# EAGLE design Tracksoar v2 (EAGLE 7.5.0)
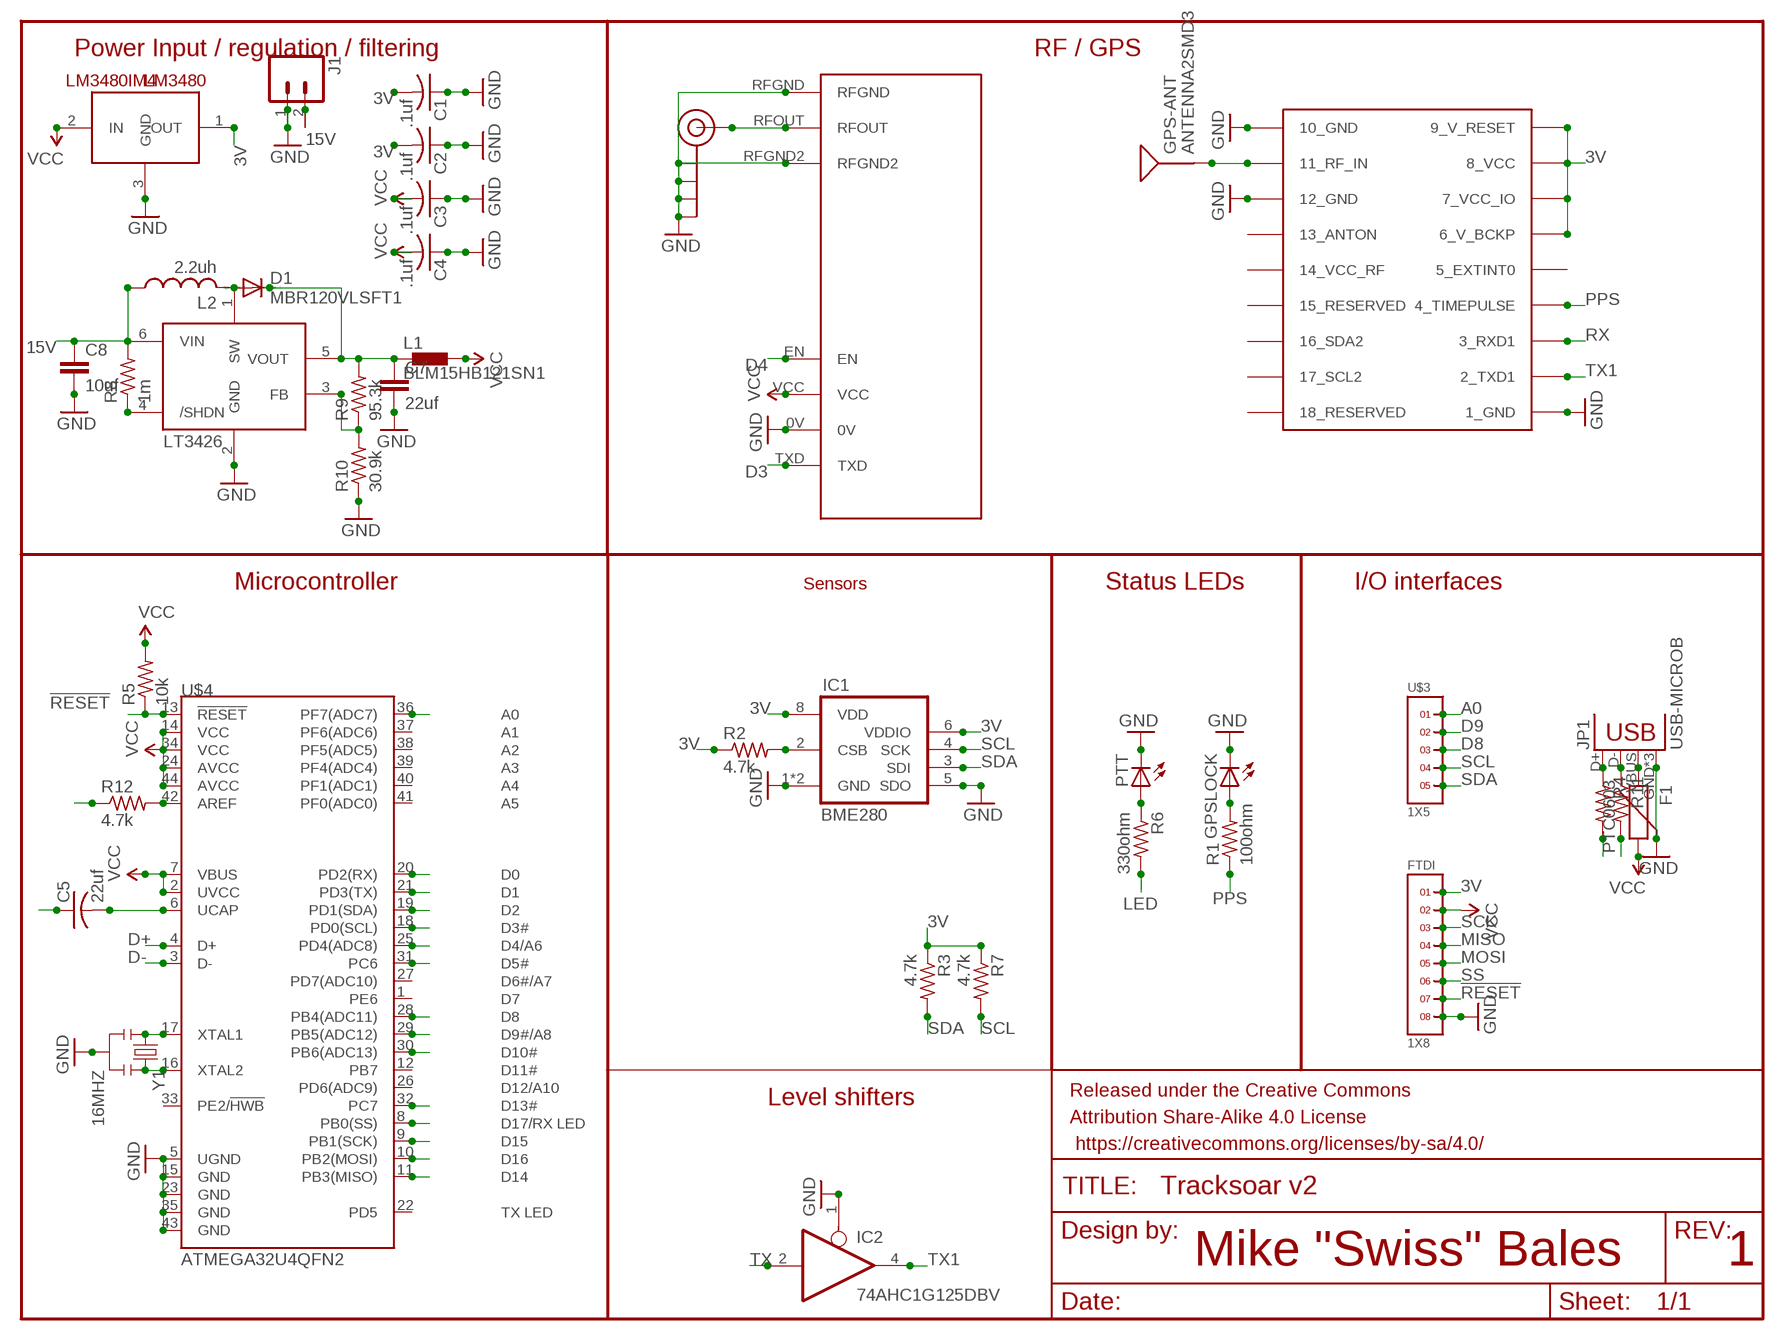
[diagram p0: schematic, sheet 1]

## Parts
C1  .1uf  C-USC0402  [C0402]
C2  .1uf  C-USC0402  [C0402]
C3  .1uf  C-USC0402  [C0402]
C4  .1uf  C-USC0402  [C0402]
C5  22uf  C-USC0402  [C0402]
C7  22uf  CAP0805  [0805]
C8  10uf  CAP0805  [0805]
D1  MBR120VLSFT1  DIODE-SOD123  [SOD123]
F1  PTC0603  [0603]
FRAME1  FRAME-LETTER  [CREATIVE_COMMONS]
FTDI  1X8  [1X8]
GPS-ANT  ANTENNA2SMD3  [ANTENNA-CHIP4]
GPSLOCK  LEDCHIP-LED0603  [CHIP-LED0603]
IC1  BME280  [BME280]
IC2  74AHC1G125DBV  [SOT23-5]
J1  M02JST-PTH-2  [JST-2-PTH]
J$1  SMA_EDGE  [SMA-EDGE]
JP1  USB-MICROB  [USB-MICROB]
L1  BLM15HB121SN1  [0402]
L2  2.2uh  L-USL1812  [L1812]
LM3480  LM3480IM4  [SOT23-3]
LT3426  LT3426  [SOT23-6]
PTT  LEDCHIP-LED0603  [CHIP-LED0603]
R1  100ohm  R-US_R0402  [R0402]
R2  4.7k  R-US_R0402  [R0402]
R3  4.7k  R-US_R0402  [R0402]
R4  R-US_R0402  [R0402]
R5  10k  R-US_R0402  [R0402]
R6  330ohm  R-US_R0402  [R0402]
R7  4.7k  R-US_R0402  [R0402]
R8  1m  R-US_R0402  [R0402]
R9  95.3k  R-US_R0402  [R0402]
R10  30.9k  R-US_R0402  [R0402]
R11  R-US_R0402  [R0402]
R12  4.7k  R-US_R0402  [R0402]
U$1  UBLOX_MAX  [UBLOX_MAX]
U$2  RADIOMETRIX-HX1  [RADIOMETRIX-HX1]
U$3  1X5  [1X5]
U$4  ATMEGA32U4QFN2  [QFN-44-NOPAD]
Y1  16MHZ  RESONATOR16MHZ  [RESONATOR-SMD]

## Nets
3V: C1.2 C2.2 FTDI.1 IC1.6(VDDIO) IC1.8(VDD) LM3480.1(OUT) R2.1 R3.1 R7.1 U$1.6_V_BCKP U$1.7_VCC_IO U$1.8_VCC U$1.9_V_RESET
15V: C8.1 J1.2 L2.1 LT3426.6(VIN) R8.2 R12.1
!RESET: FTDI.7 R5.1 U$4.13(!RESET)
A0: U$3.1 U$4.36(PF7(ADC7))
D3: U$2.TXD U$4.30(PB6(ADC13))
D4: U$2.EN U$4.25(PD4(ADC8))
D8: U$3.3 U$4.28(PB4(ADC11))
D9: U$3.2 U$4.29(PB5(ADC12))
D13: U$4.32(PC7)
D+: R4.2 U$4.4(D+)
D-: R11.2 U$4.3(D-)
GND: C1.1 C2.1 C3.1 C4.1 C5.1 C7.2 C8.2 FTDI.8 GPSLOCK.C IC1.1(GND) IC1.5(SDO) IC1.7(GND) IC2.1(OE) J1.1 J$1.GND@0(GND) J$1.GND@1(GND) J$1.GND@2(GND) J$1.GND@3(GND) JP1.GND JP1.MT1(GND) JP1.MT2(GND) LM3480.3(GND) LT3426.2(GND) PTT.C R10.1 U$1.1_GND U$1.10_GND U$1.12_GND U$2.0V U$2.RFGND U$2.RFGND2 U$4.5(UGND) U$4.15(GND) U$4.23(GND) U$4.35(GND) U$4.43(GND) Y1.2
LED: R6.2 U$4.31(PC6)
MISO: FTDI.4 U$4.11(PB3(MISO))
MOSI: FTDI.5 U$4.10(PB2(MOSI))
N$1: J$1.SIG(SIGNAL) U$2.RFOUT
N$2: IC1.2(CSB) R2.2
N$3: GPSLOCK.A R1.2
N$6: GPS-ANT.SIG(SIGNAL) U$1.11_RF_IN
N$7: JP1.D- R11.1
N$8: JP1.D+ R4.1
N$9: D1.A L2.2 LT3426.1(SW)
N$12: LT3426.4(/SHDN) R8.1
N$13: LT3426.3(FB) R9.1 R10.2
N$14: F1.1 JP1.VBUS
N$17: R12.2 U$4.42(AREF)
N$19: C7.1 D1.C L1.1 LT3426.5(VOUT) R9.2
N$20: C5.2 U$4.6(UCAP)
N$27: PTT.A R6.1
PPS: R1.1 U$1.4_TIMEPULSE
RX: U$1.3_RXD1 U$4.21(PD3(TX))
SCK: FTDI.3 U$4.9(PB1(SCK))
SCL: IC1.4(SCK) R7.2 U$3.4 U$4.18(PD0(SCL))
SDA: IC1.3(SDI) R3.2 U$3.5 U$4.19(PD1(SDA))
SS: FTDI.6 U$4.8(PB0(SS))
TX: IC2.2(I) U$4.20(PD2(RX))
TX1: IC2.4(O) U$1.2_TXD1
VCC: C3.2 C4.2 F1.2 FTDI.2 L1.2 LM3480.2(IN) R5.2 U$2.VCC U$4.2(UVCC) U$4.7(VBUS) U$4.14(VCC) U$4.24(AVCC) U$4.34(VCC) U$4.44(AVCC)
XTAL1: U$4.17(XTAL1) Y1.1
XTAL2: U$4.16(XTAL2) Y1.3
Unconnected: U$1.5_EXTINT0 U$1.13_ANTON U$1.14_VCC_RF U$1.15_RESERVED U$1.16_SDA2 U$1.17_SCL2 U$1.18_RESERVED U$4.1(PE6) U$4.12(PB7) U$4.22(PD5) U$4.26(PD6(ADC9)) U$4.27(PD7(ADC10)) U$4.33(PE2/!HWB) U$4.37(PF6(ADC6)) U$4.38(PF5(ADC5)) U$4.39(PF4(ADC4)) U$4.40(PF1(ADC1)) U$4.41(PF0(ADC0))

## Notes on the sheet
- Power Input / regulation / filtering | RF / GPS
- Microcontroller | Sensors | Status LEDs | I/O interfaces
- Level shifters
- Mike "Swiss" Bales | 1

## Power pins joined to a net without a drawn wire
GND: IC2.3(GND)
VCC: IC2.5(VCC)

## Library data of the parts
C1-C4 = adafruit:C-US: CAPACITOR, American symbol
C5 = rcl:C-US: CAPACITOR, American symbol
C7 C8 = SparkFun-Capacitors:CAP: Capacitor Standard 0603 ceramic capacitor, and 0.1" leaded capacitor.
D1 = diode:DIODE-: DIODE
F1 = SparkFun-PowerIC:PTC: Resettable Fuse PTC Resettable Fuse. Spark Fun Electronics SKU : COM-08357
FRAME1 = SparkFun-Aesthetics:FRAME-LETTER: Schematic Frame Standard 8.5x11 US Letter frame
FTDI = headers(2mm):1X8
GPS-ANT = SparkFun-RF:ANTENNA2: Chip antenna Single endded antenna. Common with smaller chip antennas. CHIP4 package is the GPS Chip Antenna SKU: GPS-08418. CHIP5 package is 2.4GHz chip antenna SKU: WRL-00144.
GPSLOCK PTT = adafruit:LED: LED OSRAM: - CHIPLED LG R971, LG N971, LY N971, LG Q971, LY Q971, LO R971, LY R971 LH N974, LH R974 LS Q976, LO Q976, LY Q976 LO Q996 - Hyper CHIPLED LW Q18S LB Q993, LB Q99A, LB R99A - SideLED LS A670, LO A670, LY A670, LG A670, LP A670 LB A673, LV A673, LT A673, LW A673 LH A674 LY A675 LS A676, LA A676, LO A676, LY A676, LW A676 LS A679, LY A679, LG A679 - Hyper Micro SIDELED® LS Y876, LA Y876, LO Y876, LY Y876 LT Y87S - SmartLED LW L88C, LW L88S LB L89C, LB L89S, LG L890 LS L89K, LO L89K, LY L89K LS L896, LA L896, LO L896, LY L896 - TOPLED LS T670, LO T670, LY T670, LG T670, LP T670 LSG T670, LSP T670, LSY T670, LOP T670, LYG T670 LG T671, LOG T671, LSG T671 LB T673, LV T673, LT T673, LW T673 LH T674 LS T676, LA T676, LO T676, LY T676, LB T676, LH T676, LSB T676, LW T676 LB T67C, LV T67C, LT T67C, LS T67K, LO T67K, LY T67K, LW E67C LS E67B, LA E67B, LO E67B, LY E67B, LB E67C, LV E67C, LT E67C LW T67C LS T679, LY T679, LG T679 LS T770, LO T770, LY T770, LG T770, LP T770 LB T773, LV T773, LT T773, LW T773 LH T774 LS E675, LA E675, LY E675, LS T675 LS T776, LA T776, LO T776, LY T776, LB T776 LHGB T686 LT T68C, LB T68C - Hyper Mini TOPLED® LB M676 - Mini TOPLED Santana® LG M470 LS M47K, LO M47K, LY M47K Source: http://www.osram.convergy.de/
IC1 = bosch-bme280:BME280: DIGITAL HUMIDITY, PRESSURE AND TEMPERATURE SENSOR * Digital interface I²C (up to 3.4 MHz) and SPI (3 and 4 wire, up to 10 MHz)* Supply voltage VDD main supply voltage range: 1.71 V to 3.6 V*VDDIO interface voltage range: 1.2 V to 3.6 V Operating range -40…+85 °C, 0…100 % rel. humidity, 300…1100 hPa The library has been designed by Richard Magdycz <https://www.facebook.com/groups/eaglecadsoftUK>
IC2 = 74xx-little-us:74*1G125: Single Bus Buffer Gate with 3-State Output
J1 = SparkFun-Connectors:M02: Standard 2-pin 0.1" header. Use with - straight break away headers ( PRT-00116) - right angle break away headers (PRT-00553) - swiss pins (PRT-00743) - machine pins (PRT-00117) - female headers (PRT-00115) Molex polarized connector foot print use with: PRT-08233 with associated crimp pins and housings. 2.54_SCREWTERM for use with PRT-10571. 3.5mm Screw Terminal footprints for PRT-08084 5mm Screw Terminal footprints for use with PRT-08432; PROD_ID: CONN-09863; SKU: PRT-09914
J$1 = SparkFun-Connectors:SMA_EDGE: SMA Antenna Connector End launch SMA connector. The paste layer has been removed so that the connector can be hand soldered onto the board after reflow.
JP1 = SparkFun-Connectors:USB: USB Connectors USB-B-PTH is fully proven SKU : PRT-00139/CONN-08278 USB-miniB is fully proven SKU : PRT-00587 USB-A-PCB is untested. USB-A-H is throughly reviewed, but untested. Spark Fun Electronics SKU : PRT-00437 USB-B-SMT is throughly reviewed, but untested. Needs silkscreen touching up. USB-A-S has not been used/tested USB-MB-H has not been used/tested USB-MICROB has been used. CONN-09505; PROD_ID: CONN-09505
L1 = inductors:BLM15H: EMIFIL (R) Chip Ferrite Bead for GHz Noise Source: http://www.murata.com/ Ferrite Bead BLM15H.pdf
L2 = resistor:L-US: INDUCTOR, American symbol
LM3480 = SparkFun-PowerIC:LM3480IM4: Small package linear regulator
LT3426 = adafruit:LT3426: LT3426 1.2MHz, 2A boost converter in SOT-23 http://www.linear.com/pc/productDetail.jsp?navId=H0,C1,C1003,C1042,C1031,C1061,P8430 (Linear website)
R1-R12 = adafruit:R-US_: RESISTOR, American symbol
U$1 = Ava:UBLOX_MAX: UBLOX MAX
U$2 = Ava:RADIOMETRIX-HX1
U$3 = headers(2mm):1X5
U$4 = SparkFun-DigitalIC:ATMEGA32U4: Atmel 44-pin 8-bit Microcontroller with 32KBytes of ISP Flash and USB Controller
Y1 = SparkFun-FreqCtrl:RESONATOR: Resonator Small SMD resonator. Used, eg, on the Arduino Pro/ Pro Mini boards. 8MHz- XTAL-08895 16MHz- XTAL-08900; PROD_ID: XTAL-08900

## Board
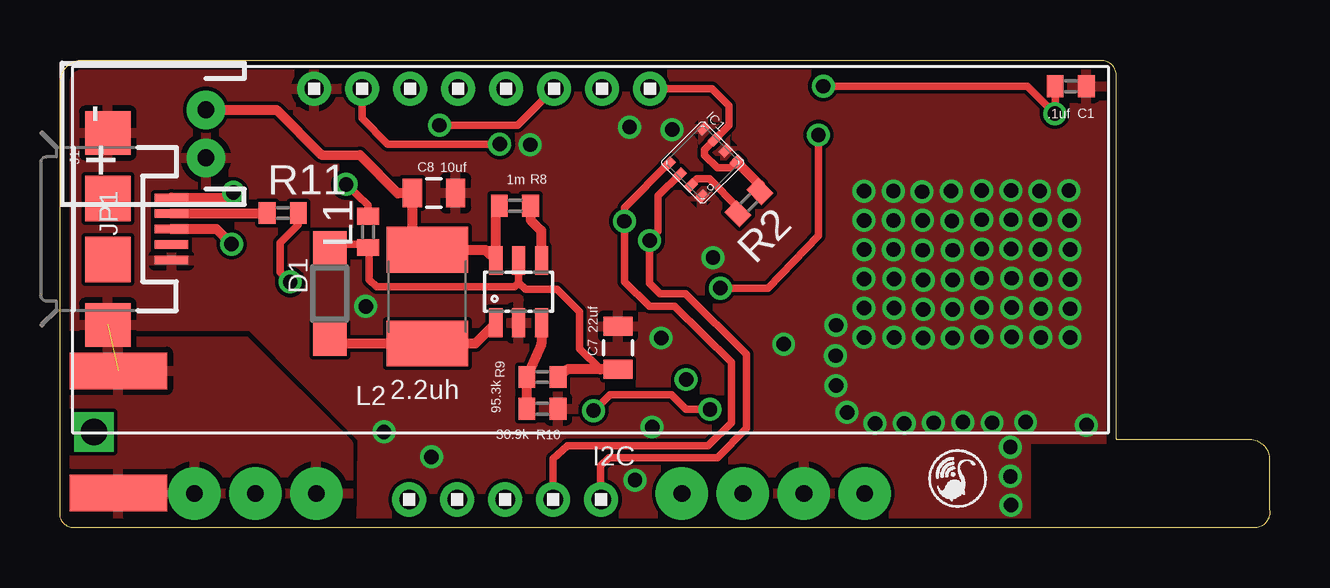
[diagram p1: board, top side]
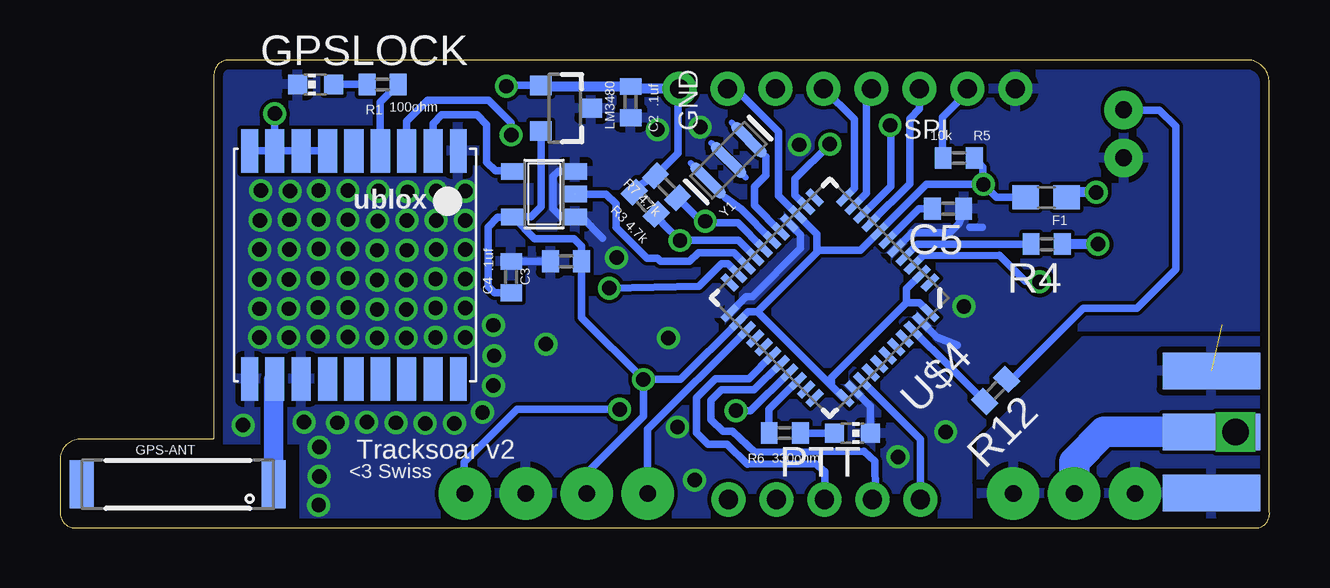
[diagram p2: board, bottom side, seen from below]

Size 50.42 x 19.48 mm. Coordinates in mm from the lower left corner, seen from the top.
Outline: 0.45,0 arc-90 0.02,0.71 0.02,18.62 arc-90 1.01,19.48 43.4,19.48 arc-90 44.01,18.82 44.01,3.73 arc90 44.06,3.68 49.6,3.68 arc-90 50.41,2.82 50.41,0.74 arc-90 49.9,0 0.45,0
Copper layers (1*16): Top 0.0356mm / dielectric 1.5011mm / Bottom 0.0356mm
Design rules "oshpark-2layer": minimum track width 6mil, minimum drill 13mil, track to track 6mil, track to pad 6mil, pad to pad 6mil, via to via 6mil, smd to smd 6mil, copper to edge 15mil, drill to drill 6mil, minimum pad ring 7mil, minimum via ring 7mil, stop-mask expansion 4mil, vias tented up to drill 0mil, thermal gap 10mil

### Footprints (pad centres in the part's own frame; a part is rotated, then mirrored left to right if it is on the bottom)
C0402 = smd 0.7 x 0.9: 1 -0.65,0; 2 0.65,0
0805 = smd 0.8 x 1.2: 1 -0.9,0; 2 0.9,0
SOD123 = smd 1.4 x 1.4: A 1.9,0; C -1.9,0
0603 = smd 1.1 x 1: 1 -0.85,0; 2 0.85,0
1X8 = drill 0.8 pad 1.422: 1 -7,0; 2 -5,0; 3 -3,0; 4 -1,0; 5 1,0; 6 3,0; 7 5,0; 8 7,0
ANTENNA-CHIP4 = smd 1 x 2: NC 4,0; SIG -4,0
CHIP-LED0603 = smd 0.8 x 0.8: A 0,-0.75; C 0,0.75
BME280 = smd 0.35 x 0.5: 1 0.975,-1.025; 2 0.325,-1.025; 3 -0.325,-1.025; 4 -0.975,-1.025; 5 -0.975,1.025; 6 -0.325,1.025; 7 0.325,1.025; 8 0.975,1.025
SOT23-5 = smd 0.69 x 0.99: 1 -0.95,-1.29; 2 0,-1.29; 3 0.95,-1.29; 4 0.95,1.3; 5 -0.95,1.3
JST-2-PTH = drill 0.7 pad 1.6: 1 -1,0; 2 1,0
SMA-EDGE = smd 1.524 x 4.064: GND@0 0,0; GND@1 5.08,0; SIG 2.54,0 | smd 1.524 x 4.064 bottom: GND@2 0,0; GND@3 5.08,0
USB-MICROB = smd 0.35 x 1.4: D+ 0,2.65; D- -0.65,2.65; GND 1.3,2.65; ID 0.65,2.65; VBUS -1.3,2.65 | smd 1.8 x 1.9: MT1 -4,0; MT2 4,0 | smd 1.9 x 1.9: P$1 -1.27,0; P$2 1.27,0
0402 = smd 0.7 x 0.9: 1 -0.65,0; 2 0.65,0
L1812 = smd 1.9 x 3.4: 1 -1.95,0; 2 1.95,0
SOT23-3 = smd 0.8 x 0.9: 1 -0.95,-1; 2 0.95,-1; 3 0,1.1
SOT23-6 = smd 0.55 x 1.2: 1 -0.95,-1.3; 2 0,-1.3; 3 0.95,-1.3; 4 0.95,1.3; 5 0,1.3; 6 -0.95,1.3
R0402 = smd 0.7 x 0.9: 1 -0.65,0; 2 0.65,0
UBLOX_MAX = smd 1.8 x 0.7: 1_GND 4.95,-4.4; 9_V_RESET 4.95,4.3; 10_GND -4.55,4.3; 18_RESERVED -4.55,-4.4 | smd 1.8 x 0.8: 2_TXD1 4.95,-3.35; 3_RXD1 4.95,-2.25; 4_TIMEPULSE 4.95,-1.15; 5_EXTINT0 4.95,-0.05; 6_V_BCKP 4.95,1.05; 7_VCC_IO 4.95,2.15; 8_VCC 4.95,3.25; 11_RF_IN -4.55,3.25; 12_GND -4.55,2.15; 13_ANTON -4.55,1.05; 14_VCC_RF -4.55,-0.05; 15_RESERVED -4.55,-1.15; 16_SDA2 -4.55,-2.25; 17_SCL2 -4.55,-3.35
RADIOMETRIX-HX1 = drill 0.7 pad 2.184: 0V 8.89,-10.16; EN 3.81,-10.16; RFGND -11.43,-10.16; RFGND2 -16.51,-10.16; RFOUT -13.97,-10.16; TXD 11.43,-10.16; VCC 6.35,-10.16
1X5 = drill 0.8 pad 1.422: 1 -4,0; 2 -2,0; 3 0,0; 4 2,0; 5 4,0
QFN-44-NOPAD = smd 0.8 x 0.3: 1 -3.4,2.5; 2 -3.4,2; 3 -3.4,1.5; 4 -3.4,1; 5 -3.4,0.5; 6 -3.4,0; 7 -3.4,-0.5; 8 -3.4,-1; 9 -3.4,-1.5; 10 -3.4,-2; 11 -3.4,-2.5; 23 3.4,-2.5; 24 3.4,-2; 25 3.4,-1.5; 26 3.4,-1; 27 3.4,-0.5; 28 3.4,0; 29 3.4,0.5; 30 3.4,1; 31 3.4,1.5; 32 3.4,2; 33 3.4,2.5 | smd 0.3 x 0.8: 12 -2.5,-3.4; 13 -2,-3.4; 14 -1.5,-3.4; 15 -1,-3.4; 16 -0.5,-3.4; 17 0,-3.4; 18 0.5,-3.4; 19 1,-3.4; 20 1.5,-3.4; 21 2,-3.4; 22 2.5,-3.4; 34 2.5,3.4; 35 2,3.4; 36 1.5,3.4; 37 1,3.4; 38 0.5,3.4; 39 0,3.4; 40 -0.5,3.4; 41 -1,3.4; 42 -1.5,3.4; 43 -2,3.4; 44 -2.5,3.4
RESONATOR-SMD = smd 0.45 x 1.905: 1 -1.2,0; 2 0,0; 3 1.2,0

### Placement (x,y rotation side)
C1  42.13,18.39 180 top
C2  26.64,17.73 90 bottom
C3  29.33,11.1 0 bottom
C4  31.61,10.44 270 bottom
C5  13.4,13.28 180 bottom
C7  23.26,7.49 90 top
C8  15.59,13.94 0 top
D1  11.24,9.75 270 top
F1  9.31,13.77 180 bottom
FRAME1  14.37,-8.23 0 top  (outside the outline)
FTDI  17.59,18.29 180 top
GPS-ANT  45.51,1.8 180 bottom
GPSLOCK  39.77,18.47 90 bottom
IC1  26.79,15.21 315 top
IC2  30.24,13.89 90 bottom
J1  6.09,16.41 90 top
J$1  2.43,1.45 90 bottom
JP1  2,12.45 270 top
L1  12.84,12.32 90 top
L2  15.31,9.63 270 top
LM3480  29.38,17.48 270 bottom
LT3426  19.12,9.83 0 top
PTT  17.39,3.94 270 bottom
R1  36.97,18.47 180 bottom
R2  28.72,13.54 225 top
R3  26.03,13.51 315 bottom
R4  9.29,11.81 180 bottom
R5  12.96,15.4 0 bottom
R6  20.21,3.94 180 bottom
R7  25.14,14.2 315 bottom
R8  18.96,13.41 180 top
R9  20.11,6.27 0 top
R10  20.11,4.95 180 top
R11  9.29,13.11 0 top
R12  11.42,5.71 225 bottom
U$1  38.22,10.74 90 bottom
U$2  22.11,11.58 0 top
U$3  18.56,1.17 0 top
U$4  18.33,9.58 225 bottom
Y1  22.56,15.31 45 bottom

### Tracks (layer width: path | path; a pad name or v marks a point on that pad's centre or on a via)
3V  (via drill 0.6)
  Top 0.305: IC1.8 27.94,14.99 27.4,14.99 26.86,15.52 26.86,15.75 IC1.6 27.88,16.77 27.88,17.58 27.17,18.29 FTDI.1 | C1.2 41.48,17.26 v41.47,17.25 40.33,18.39 v31.82,18.39
  Top 0.406: R2.1 29.18,14.27 IC1.8
  Bottom 0.305: R3.1 26.16,14.33 R7.1 24.65,15.6 24.65,17.74 FTDI.1 | U$1.9_V_RESET U$1.8_VCC | U$1.8_VCC U$1.7_VCC_IO U$1.6_V_BCKP | v41.47,17.25 U$1.8_VCC | LM3480.1 31.78,18.42 v31.82,18.39
  Bottom 0.406: FTDI.1 26.29,18.29 C2.2 30.33,18.38 LM3480.1
15V
  Top 0.406: R8.2 18.17,13.26 LT3426.6 17.72,11.58 L2.1 14.69,12.2 C8.1 14.11,13.94 14.09,13.92 12.5,15.52 10.89,15.54 9.02,17.41 J1.2
  Bottom 0.305: R12.1 10.73,6.17 7.76,9.14 5.53,9.14 3.9,10.77 3.9,16.71 4.59,17.4 6.08,17.4 J1.2
!RESET  (via drill 0.6)
  Top 0.305: v18.33,15.98 13.66,15.98 12.59,17.06 FTDI.7
  Bottom 0.305: U$4.13 19.78,13.85 19.78,14.53 v18.33,15.98 | FTDI.7 12.59,18.13 13.63,17.09 13.63,15.43 R5.1
A0
  Bottom 0.305: U$4.36 14.56,3.68 U$3.1
D3  (via drill 0.6)
  Top 0.305: v22.24,4.88 22.27,4.88 22.93,5.54 25.49,5.54 26.1,4.93 v27.09,4.93
  Bottom 0.305: U$4.30 21.63,4.88 v22.24,4.88 | v27.09,4.93 31.36,4.93 33.57,2.72 33.57,1.45 U$2.TXD
D4
  Bottom 0.305: U$4.25 25.92,4.1 U$2.EN
D8
  Bottom 0.305: U$4.28 21.71,6.2 23.11,6.2 23.89,5.41 23.89,3.96 23.41,3.48 22.62,3.48 21.76,2.64 18.94,2.67 18.53,2.34 U$3.3
D9
  Bottom 0.305: U$4.29 21.48,5.74 22.85,5.74 23.28,5.31 23.28,4.5 22.78,4.01 22.39,4.01 21.45,3.15 16.91,3.17 16.45,2.77 16.43,1.43 U$3.2
D+
  Bottom 0.305: R4.2 14.68,11.81 U$4.4
D-  (via drill 0.6)
  Top 0.305: 9.87,13.04 R11.2 9.94,12.61 9.19,11.86 9.19,10.64 v9.59,10.24
  Bottom 0.305: U$4.3 14.46,11.33 11.27,11.35 10.18,10.26 v9.59,10.24
GND  (via drill 0.6)  (1 unrouted)
  Bottom 0.305: U$4.15 19.55,12.21 19.55,11.63 21.56,9.63 21.84,9.63 22.5,8.96 U$4.23 | C3.1 C4.1 | 27.8,12.06 28.68,12.94 IC2.1 28.96,12.95 29.53,12.95 29.86,13.28 29.86,14.63 29.65,14.84 IC2.3 | U$4.43 13.86,7.93 13.02,7.59 | U$4.5 14.91,12.29 13.33,12.29 12.96,12.66 C5.1 | 12.5,12.52 11.98,12.52 | U$4.35 16.64,5.06 PTT.C
  other vias: 23.74,16.69 30.17,7.65 25.52,16.59 15.49,2.95 33.52,14.02 33.52,10.36 33.52,12.8 33.52,11.58 33.52,9.14 33.52,7.92 34.76,7.92 34.76,9.14 34.76,10.36 34.74,11.58 34.74,12.8 34.74,14.02 35.93,14 35.96,12.8 35.96,11.56 35.98,10.31 35.98,9.09 35.98,7.9 37.2,7.9 37.2,9.09 37.2,10.31 37.2,11.56 37.18,12.78 37.15,14.02 32.35,8.43 32.33,7.16 32.35,5.92 32.81,4.8 39.62,2.13 39.62,3.35 40.25,4.39 42.79,4.27 39.64,0.94 38.42,14.05 38.42,10.39 38.42,12.83 38.42,11.61 38.42,9.17 38.42,7.95 39.67,7.95 39.67,9.17 39.67,10.39 39.64,11.61 39.64,12.83 39.64,14.05 40.83,14.02 40.86,12.83 40.86,11.58 40.89,10.34 40.89,9.12 40.89,7.92 42.1,7.92 42.1,9.12 42.1,10.34 42.1,11.58 42.08,12.8 42.05,14.05 33.98,4.34 35.2,4.34 36.41,4.37 37.63,4.39 38.85,4.37 23.97,1.98 19.6,15.95 25.06,7.9 27.22,11.25 24.68,4.19 12.74,9.22 13.5,3.99
  pour Top: 0.02,19.51 44.03,19.51 44.03,3.68 40.25,3.68 40.25,-0.05 12.56,-0.05 12.61,3.71 7.97,8.38 0.02,8.38
  pour Bottom: 0.02,19.51 44.03,19.51 44.03,3.68 40.25,3.68 40.25,-0.05 12.56,-0.05 12.61,3.71 7.97,8.38 0.02,8.38
  pour Bottom: 0.02,7.77 7.74,7.77 12.01,3.51 12.01,-0.05 0.02,-0.05
  pour Top: 0.02,7.77 7.74,7.77 12.01,3.51 12.01,-0.05 0.02,-0.05
LED
  Bottom 0.305: U$4.31 20.86,4.92 R6.2
MISO
  Bottom 0.305: 17.59,13.85 U$4.11 17.69,13.77 17.31,14.15 17.31,17.01 FTDI.4
MOSI
  Bottom 0.305: U$4.10 16.81,13.93 16.81,17.7 16.59,17.92 FTDI.5
N$1
  Bottom 1.27: J$1.SIG 6.9,3.99 8.14,2.74 U$2.RFOUT
N$2
  Top 0.305: R2.2 28.26,13.34 27.07,14.53 26.56,14.53 IC1.2
N$3
  Bottom 0.305: GPSLOCK.A R1.2
N$6
  Bottom 0.305: U$1.11_RF_IN 41.51,6.15
  Bottom 0.813: 41.51,6.15 GPS-ANT.SIG
N$7
  Top 0.406: JP1.D- 8.63,13.1 R11.1
N$8  (via drill 0.6)
  Top 0.406: JP1.D+ 6.52,12.45 v7.15,11.81
  Bottom 0.406: v7.15,11.81 R4.1
N$9
  Top 0.406: D1.A 11.93,7.68 L2.2 17.31,7.68 LT3426.1
N$12
  Top 0.406: R8.1 19.62,12.81 20.06,12.37 20.06,11.14 LT3426.4
N$13
  Top 0.406: R10.2 R9.1 20.07,7.67 LT3426.3
N$14  (via drill 0.6)
  Top 0.406: JP1.VBUS 6.9,13.75 v7.23,13.97
  Bottom 0.406: v7.23,13.97 8.34,13.97 F1.1
N$17
  Bottom 0.305: U$4.42 13.34,6.7 R12.2
N$18  (via drill 1.1)
  other vias: 1.41,3.99
N$19
  Top 0.305: D1.C 11.6,11.81 12.71,11.81 L1.1 12.84,11.48 12.89,11.43 12.89,10.34 13.2,10.03 18.94,10.03 19.12,10.21 | LT3426.5 19.12,10.21 | 19.12,10.21 19.4,9.93 20.72,9.93 21.66,8.99 21.66,7.46 22.52,6.59
  Top 0.406: C7.1 22.52,6.59 21.14,6.59 R9.2
N$20
  Bottom 0.305: U$4.6 14.62,13.28 C5.2
N$27
  Bottom 0.305: R6.1 PTT.A
PPS
  Bottom 0.305: R1.1 37.07,17.72 U$1.4_TIMEPULSE
RX  (via drill 0.6)
  Top 0.305: v27.53,9.98 29.51,9.98 31.61,12.17 v31.61,16.36
  Bottom 0.305: U$4.21 22.58,11 22.85,11 23.79,10.06 v27.53,9.98 | U$1.3_RXD1 35.97,16.93 35.09,17.81 32.55,17.81 31.61,16.87 v31.61,16.36
SCK  (via drill 0.6)
  Top 0.305: v15.82,16.76 19.07,16.76 FTDI.3
  Bottom 0.305: U$4.9 16.97,13.04 15.79,14.22 15.79,15.93 v15.82,16.76
SCL  (via drill 0.6)
  Top 0.305: IC1.4 23.52,13.33 v23.52,12.76 23.54,11.23 23.54,10.24 24.58,9.22 25.62,9.22 27.98,6.88 27.98,4.37 27.02,3.4 21.15,3.4 20.56,2.86 U$3.4
  Bottom 0.305: U$4.18 22.16,12.7 23.46,12.7 v23.52,12.76 23.84,12.9 R7.2
SDA  (via drill 0.6)
  Top 0.305: IC1.3 24.93,13.82 24.93,12.34 24.58,11.99 v24.58,11.96 24.58,10.19 25.01,9.75 26.08,9.75 28.62,7.21 28.62,4.14 27.4,2.92 22.88,2.92 22.53,2.58 U$3.5
  Bottom 0.305: U$4.19 22.13,11.96 v24.58,11.96 25.26,12.65 R3.2
SS
  Bottom 0.305: U$4.8 16.63,12.69 15,14.33 15,17.04 14.59,17.45 FTDI.6 14.55,18.24
TX
  Bottom 0.305: U$4.20 22.33,11.46 23.82,11.46 24.17,11.1 25.39,11.1 25.52,11.23 25.95,11.23 27.25,12.52 27.25,13.49 27.65,13.89 IC2.2
TX1
  Bottom 0.305: U$1.2_TXD1 34.87,16.84 34.51,17.2 33.04,17.2 32.63,16.79 32.63,15.21 32.27,14.86 31.56,14.86 IC2.4
VCC  (via drill 0.6)
  Top 0.305: L1.2 12.84,13.44 v11.93,14.3
  Bottom 0.305: 21.35,8.99 21.74,8.99 U$4.24 24.56,6.17 v26.1,6.17 | 21.35,8.99 18.27,5.91 | 18.27,5.91 17.77,5.4 U$4.34 | U$4.44 14.59,9.37 15.13,9.37 | 15.13,9.37 18.27,6.24 18.27,5.91 | 21.35,8.99 18.86,11.48 18.86,11.56 | 18.86,11.56 18.86,12.22 19.67,13.03 U$4.14 20.46,13.83 20.46,16.48 22.28,18.3 FTDI.2 | U$2.VCC 28.46,2.27 26.1,4.63 v26.1,6.17 | C4.2 32.31,9.79 32.58,10.06 32.58,12.52 32.17,12.93 31.56,12.93 IC2.5 | IC2.5 30.79,12.94 30.37,13.36 30.37,16.52 LM3480.2 | IC2.5 30.64,12.04 29,12.04 28.68,11.72 C3.2 28.68,8.75 v26.1,6.17 | 18.86,11.56 17.06,11.56 U$4.7 14.31,14.3 v11.93,14.3 | U$4.2 15.13,9.95 15.13,9.37 | v11.93,14.3 11.95,15.02 R5.2 | F1.2 11.4,13.77 v11.93,14.3
XTAL1
  Bottom 0.305: U$4.17 22.02,13.26 22.69,13.75
XTAL2
  Bottom 0.305: U$4.16 21.48,13.43 21.48,14.2 20.99,14.69 20.99,15.44

### Text on the board
tNames: - | + | I2C
bNames: GND | SPI | Tracksoar v2 | <3 Swiss